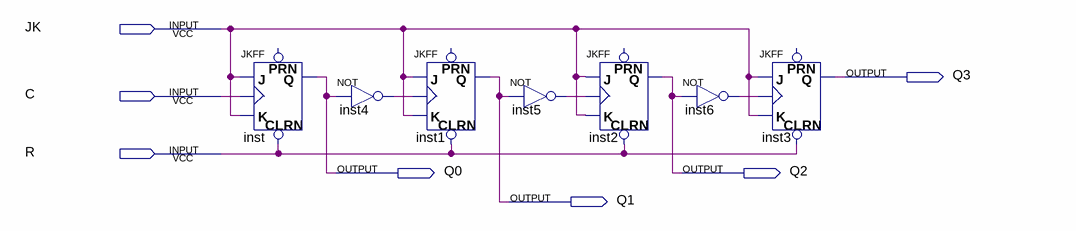
[diagram p0: schematic sheet]
// Quartus schematic point3.bdf as structural Verilog: 7 symbols, 7 pins
module point3 (
  input  JK,
  input  C,
  input  R,
  output Q3,
  output Q0,
  output Q2,
  output Q1
);

  wire inst4_out, inst5_out, inst6_out;

  JKFF inst (.CLRN(R), .K(JK), .J(JK), .CLK(C), .Q(Q0));  // open: PRN
  not inst4 (inst4_out, Q0);
  JKFF inst1 (.CLRN(R), .K(JK), .J(JK), .CLK(inst4_out), .Q(Q1));  // open: PRN
  not inst5 (inst5_out, Q1);
  JKFF inst2 (.CLRN(R), .K(JK), .J(JK), .CLK(inst5_out), .Q(Q2));  // open: PRN
  not inst6 (inst6_out, Q2);
  JKFF inst3 (.CLRN(R), .K(JK), .J(JK), .CLK(inst6_out), .Q(Q3));  // open: PRN
endmodule
